# Altium schematic sheet CAM_LCD.SchDoc
size A3; SheetNumber: 2; SheetTotal: 2
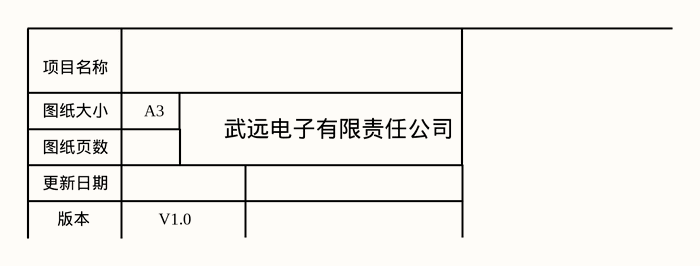
[diagram p0: CAM_LCD.SchDoc]

## Notes on the sheet
- 项目名称
- 图纸大小
- A3
- 更新日期
- 图纸页数
- 武远电子有限责任公司
- 版本
- V1.0